# EasyEDA Pro project ProPrj_基于STM32单片机自带校准和温湿度补偿报警的超声波测距仪_2025-01-02.epro, schematic 超声波测距仪
Board Name: 超声波测距仪; Create Date: 2024-11-05; Page Name: 刘嘉俊20223004426; Project Name: 基于STM32单片机自带校准和温湿度补偿报警的超声波测距仪; Schematic Name: 超声波测距仪; Update Date: 2024-12-27; Company: 海南大学-刘嘉俊-电子3班; Drawed: 刘嘉俊; Page Size: A3; Reviewed: 刘嘉俊; Version: Ver1.1
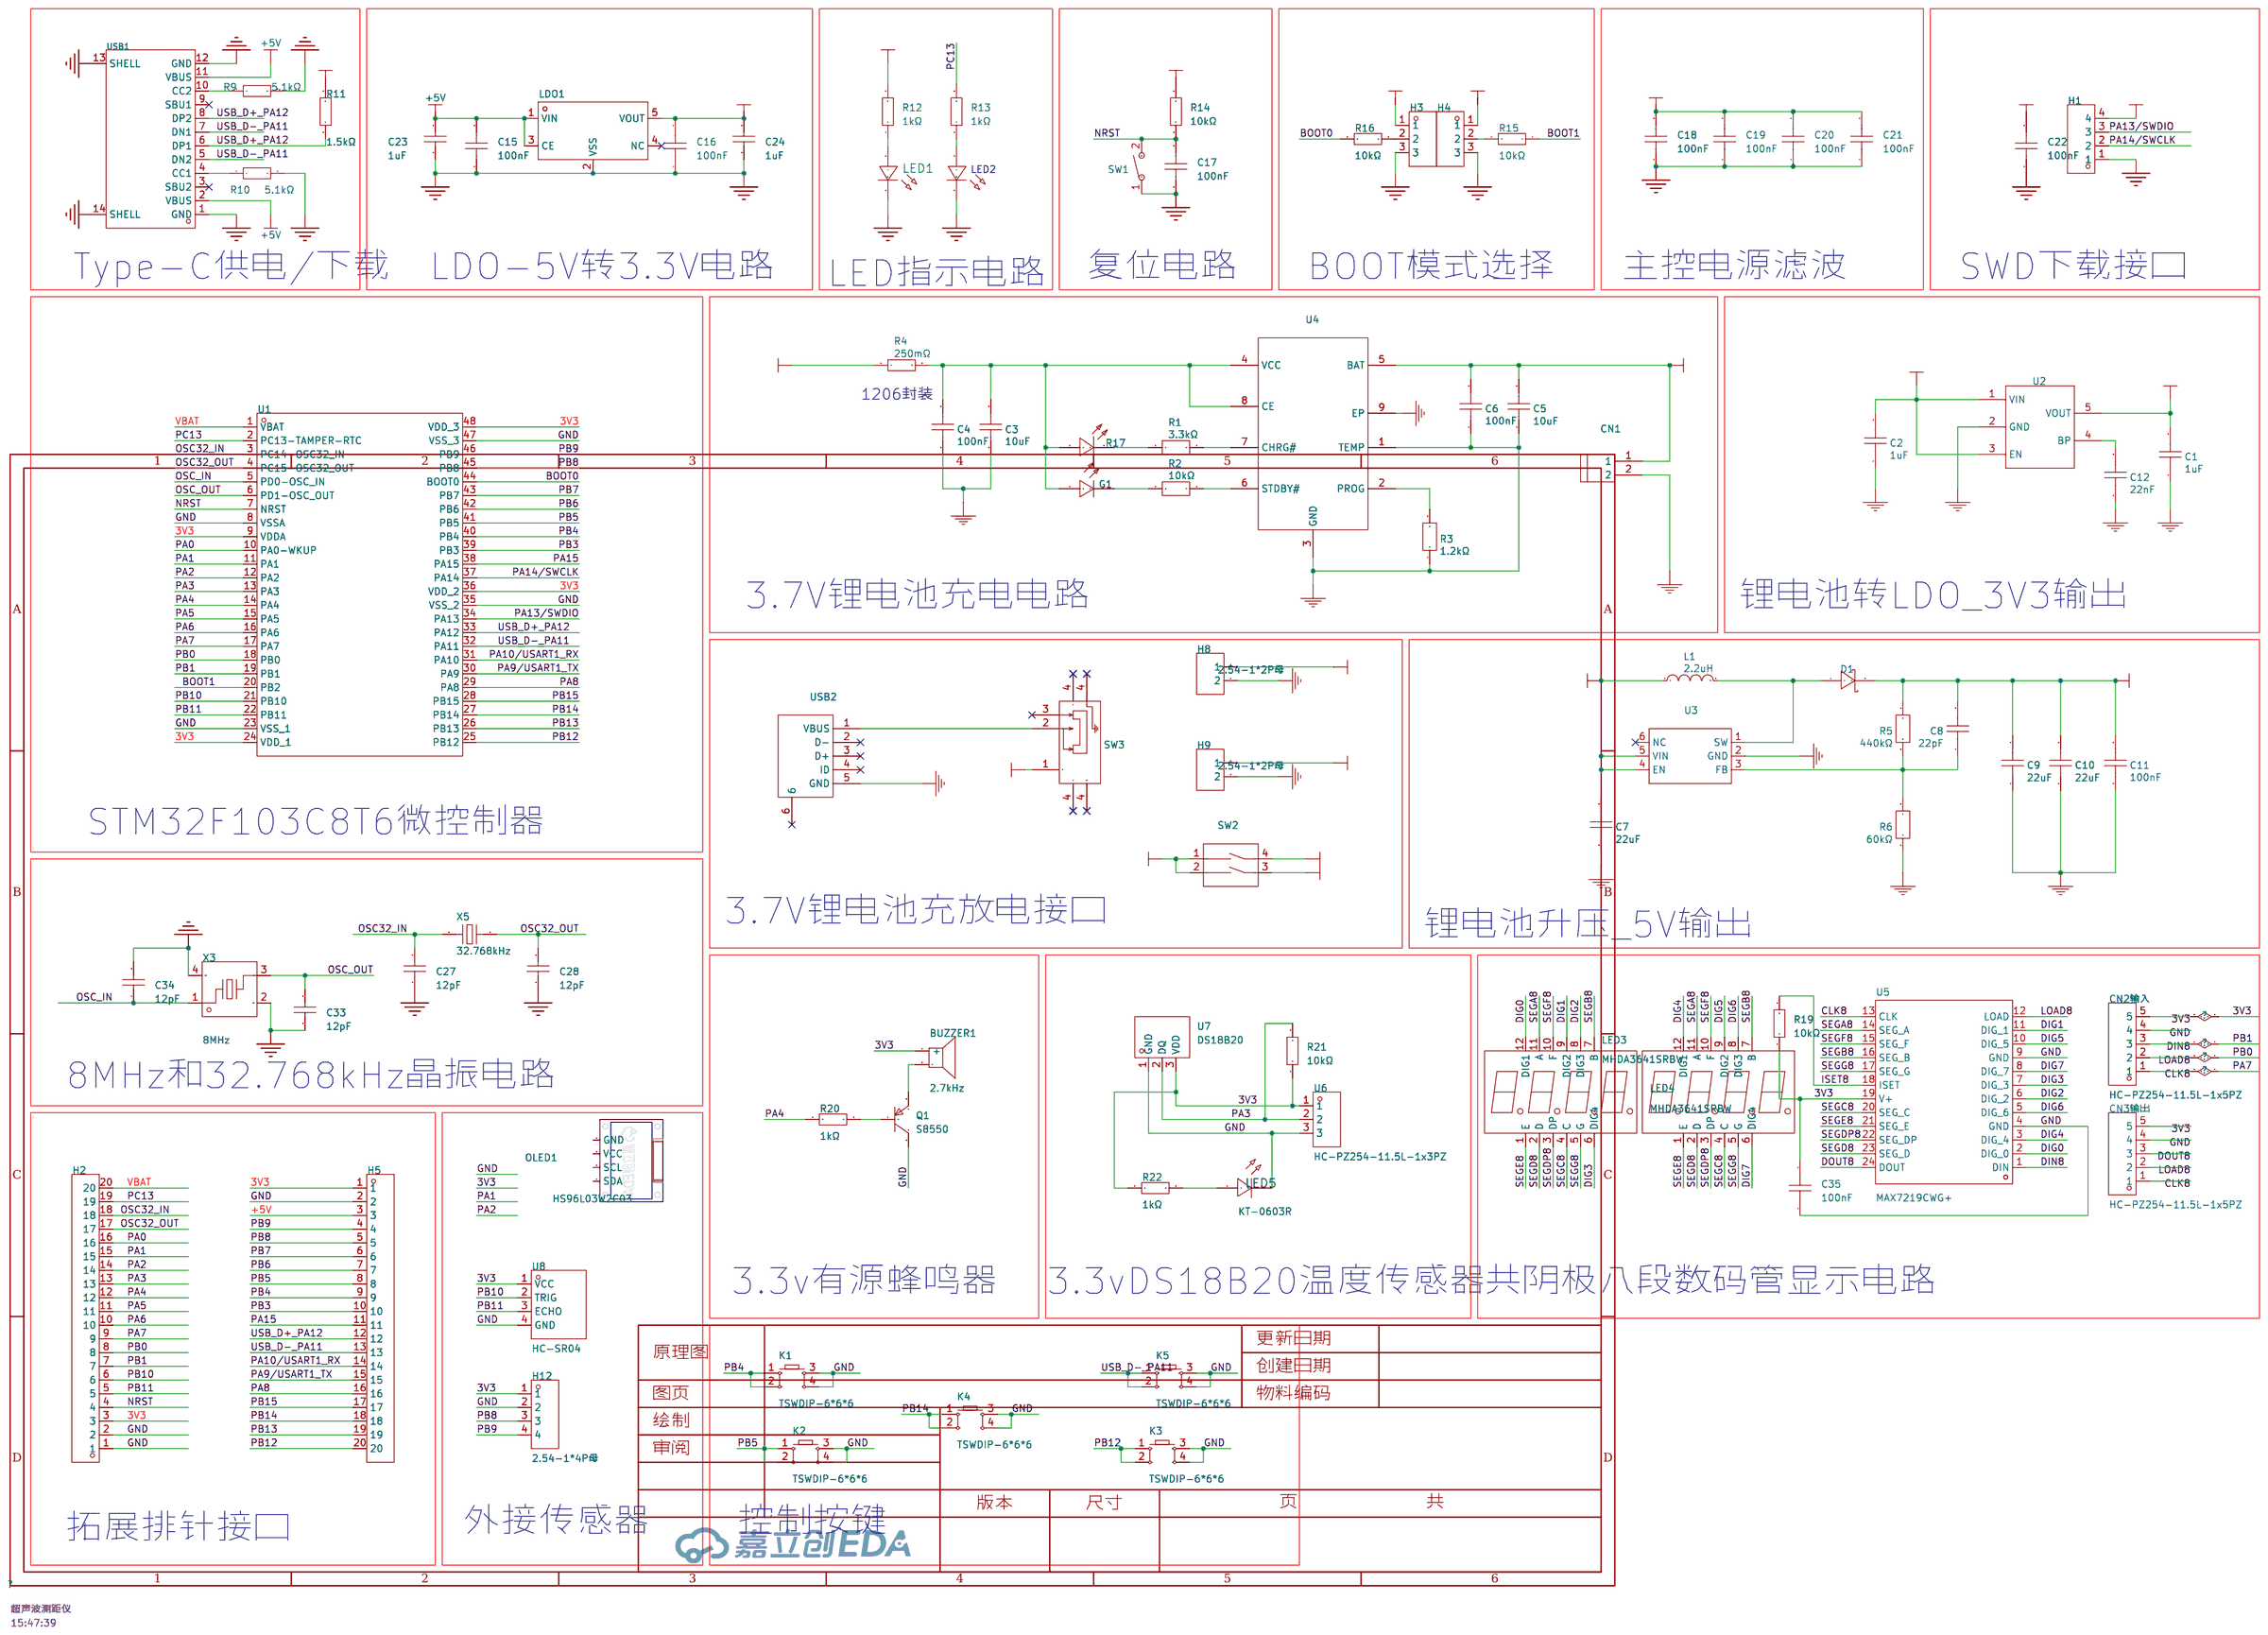
[diagram p0: schematic sheet]

## Parts
BUZZER1  2.7kHz  [BUZ-TH_BD12.0-P7.60-D0.6-FD]
C1  1uF  [C0603]
C2  1uF  [C0603]
C3  10uF  [C0805]
C4  100nF  [C0603]
C5  10uF  [C0805]
C6  100nF  [C0603]
C7  22uF  [C0805]
C8  22pF  [C0603]
C9  22uF  [C0805]
C10  22uF  [C0805]
C11  100nF  [C0603]
C12  22nF  [C0603]
C15  100nF  [C0402]
C16  100nF  [C0402]
C17  100nF  [C0402]
C18  100nF  [C0402]
C19  100nF  [C0402]
C20  100nF  [C0402]
C21  100nF  [C0402]
C22  100nF  [C0402]
C23  1uF  [C0402]
C24  1uF  [C0402]
C27  12pF  [C0402]
C28  12pF  [C0402]
C33  12pF  [C0402]
C34  12pF  [C0402]
C35  100nF  [C0603]
CN1  XH-2AW  [CONN-TH_2P-P2.50_XH-2AW]
CN2输入  HC-PZ254-11.5L-1x5PZ  [HDR-TH_5P-P2.54-V-M]
CN3输出  HC-PZ254-11.5L-1x5PZ  [HDR-TH_5P-P2.54-V-M]
D1  SS34  [SMA_L4.3-W2.6-LS5.2-RD]
G1  NCD0603G1  [LED0603-RD_1]
H1  DZ254W-11-04-65  [HDR-TH_4P-P2.54-H-M-W10.3]
H2  2.54-1*20P直针  [HDR-TH_20P-P2.54-V-M-1]
H3  PZ254V-11-03P  [HDR-TH_3P-P2.54-V-M]
H4  PZ254V-11-03P  [HDR-TH_3P-P2.54-V-M]
H5  2.54-1*20P直针  [HDR-TH_20P-P2.54-V-M-1]
H8  2.54-1*2P母  [HDR-TH_2P-P2.54-V-F]
H9  2.54-1*2P母  [HDR-TH_2P-P2.54-V-F]
H12  2.54-1*4P母  [HDR-TH_4P-P2.54-V-F]
K1  TSWDIP-6*6*6  [KEY-TH_4P-L6.0-W6.0-P4.50-LS6.50]
K2  TSWDIP-6*6*6  [KEY-TH_4P-L6.0-W6.0-P4.50-LS6.50]
K3  TSWDIP-6*6*6  [KEY-TH_4P-L6.0-W6.0-P4.50-LS6.50]
K4  TSWDIP-6*6*6  [KEY-TH_4P-L6.0-W6.0-P4.50-LS6.50]
K5  TSWDIP-6*6*6  [KEY-TH_4P-L6.0-W6.0-P4.50-LS6.50]
L1  2.2uH  [IND-SMD_L5.0-W5.0]
LDO1  ME6211C33M5G-N  [SOT-23-5_L3.0-W1.7-P0.95-LS2.8-BL]
LED1  NCD0603R1  [LED0603-RD_RED]
LED2  NCD0603B1  [LED0603-RD]
LED3  MHDA3641SRBW  [LED-SEG-TH_12P-L30.0-W14.0-P2.54-S10.26-BL]
LED4  MHDA3641SRBW  [LED-SEG-TH_12P-L30.0-W14.0-P2.54-S10.26-BL]
LED5  KT-0603R  [LED0603-RD]
OLED1  HS96L03W2C03  [OLED-TH_L27.8-W27.2-P2.54_C9900033791]
Q1  S8550  [SOT-23-3_L2.9-W1.6-P1.90-LS2.8-BR]
R1  3.3kΩ  [R0603]
R2  10kΩ  [R0603]
R3  1.2kΩ  [R0603]
R4  250mΩ  [R1206]
R5  440kΩ  [R0603]
R6  60kΩ  [R0603]
R9  5.1kΩ  [R0402]
R10  5.1kΩ  [R0402]
R11  1.5kΩ  [R0402]
R12  1kΩ  [R0402]
R13  1kΩ  [R0402]
R14  10kΩ  [R0402]
R15  10kΩ  [R0402]
R16  10kΩ  [R0402]
R17  KT-0603R  [LED0603-RD]
R19  10kΩ  [R0603]
R20  1kΩ  [R0603]
R21  10kΩ  [R0603]
R22  1kΩ  [R0603]
SW1  TS-1101-B-W  [KEY-SMD_2P-L6.0-W3.6-P7.4-LS8.0-L]
SW2  DSDP02LHGET  [SW-TH_DSDP02LHG]
SW3  MSK12C02-HB  [SW-TH_MSK12C02-HB-1]
U1  STM32F103C8T6  [LQFP-48_L7.0-W7.0-P0.50-LS9.0-BL]
U2  RT9193-33GB  [SOT-23-5_L3.0-W1.7-P0.95-LS2.8-BL]
U3  MST9220BSF  [SOT-23-6_L2.9-W1.6-P0.95-LS2.8-BR]
U4  TP4056-42-ESOP8  [ESOP-8_L4.9-W3.9-P1.27-LS6.0-BL-EP]
U5  MAX7219CWG+  [SOIC-24_L15.4-W7.5-P1.27-LS10.3-BL]
U6  HC-PZ254-11.5L-1x3PZ  [HDR-TH_3P-P2.54-V-M]
U7  DS18B20  [TO-92-3_L4.9-W3.7-P1.27-L]
U8  HC-SR04  [TH_HC-SR04V]
USB1  TYPE-C 16PIN 2MD(073)  [USB-C-SMD_TYPE-C-6PIN-2MD-073]
USB2  MICRO5.9mmusb  [MICRO-USB-SMD_5P-P0.65-H-F_MICRO5.9MMUSB]
X3  8MHz  [CRYSTAL-SMD_4P-L3.2-W2.5-BL-1]
X5  32.768kHz  [OSC-SMD_L3.2-W1.5]

## Library data of the parts
BUZZER1 = TMB12A05_C96093: 驱动方式:有源(内含驱动线路);构造类型:电磁式;频率:2.7kHz;声压(SPL):85dB;; LCSC Part Name: TMB12A05; Supplier Part: C96093; Manufacturer: 华能; Manufacturer Part: TMB12A05; Supplier Footprint: 插件,D=12mm; JLCPCB Part Class: 扩展库; Datasheet: https://atta.szlcsc.com/upload/public/pdf/source/20230426/A4FC10532558AA232D532AB83455FBA4.pdf; Supplier: LCSC; Oscillator Circuit: 有源(内含驱动线路); Technology Type: 电磁式; Operating Voltage: 4V~8V; Sound Pressure Level (SPL): 85dB; Diameter (φD): 12mm; Height: 9.8mm
C1 C2 = CL10A105KB8NNNC: 容值:1uF;精度:±10%;额定电压:50V;材质(温度系数):X5R;; LCSC Part Name: 1uF ±10% 50V; Supplier Part: C15849; Manufacturer: SAMSUNG(三星); Supplier Footprint: 0603; JLCPCB Part Class: Basic Part; Datasheet: https://atta.szlcsc.com/upload/public/pdf/source/20160218/1457707763339.pdf; Supplier: LCSC; Tolerance: ±10%; Voltage Rated: 50V; Temperature Coefficient: X5R
C3 C5 = CL21A106KAYNNNE_C15850: 容值:10uF;精度:±10%;额定电压:25V;材质(温度系数):X5R;; LCSC Part Name: 10uF ±10% 25V; Supplier Part: C15850; Manufacturer: SAMSUNG(三星); Manufacturer Part: CL21A106KAYNNNE; Supplier Footprint: 0805; JLCPCB Part Class: Basic Part; Datasheet: https://atta.szlcsc.com/upload/public/pdf/source/20160218/1457707763339.pdf; Supplier: LCSC; Tolerance: ±10%; Voltage Rated: 25V; Temperature Coefficient: X5R
C4 C6 C11 C35 = CC0603KRX7R9BB104: 容值:100nF;精度:±10%;额定电压:50V;材质(温度系数):X7R;; LCSC Part Name: 100nF ±10% 50V; Supplier Part: C14663; Manufacturer: YAGEO(国巨); Supplier Footprint: 0603; JLCPCB Part Class: Basic Part; Datasheet: https://atta.szlcsc.com/upload/public/pdf/source/20180910/C282072_33301C7F631E79921B82A8DAC6BCC5B3.pdf; Supplier: LCSC; Tolerance: ±10%; Voltage Rated: 50V; Temperature Coefficient: X7R
C7 C9 C10 = CL21A226MAQNNNE: 容值:22uF;精度:±20%;额定电压:25V;材质(温度系数):X5R;; LCSC Part Name: 22uF ±20% 25V; Supplier Part: C45783; Manufacturer: SAMSUNG(三星); Supplier Footprint: 0805; JLCPCB Part Class: Basic Part; Datasheet: https://atta.szlcsc.com/upload/public/pdf/source/20160218/1457707763339.pdf; Supplier: LCSC; Tolerance: ±20%; Voltage Rated: 25V; Temperature Coefficient: X5R
C8 = CL10C220JB8NNNC: 容值:22pF;精度:±5%;额定电压:50V;材质(温度系数):C0G;; LCSC Part Name: 22pF ±5% 50V; Supplier Part: C1653; Manufacturer: SAMSUNG(三星); Supplier Footprint: 0603; JLCPCB Part Class: Basic Part; Datasheet: https://atta.szlcsc.com/upload/public/pdf/source/20160218/1457707763339.pdf; Supplier: LCSC; Tolerance: ±5%; Voltage Rated: 50V; Temperature Coefficient: C0G
C12 = CL10B223KB8NNNC: 容值:22nF;精度:±10%;额定电压:50V;材质(温度系数):X7R;; LCSC Part Name: 22nF ±10% 50V; Supplier Part: C21122; Manufacturer: SAMSUNG(三星); Supplier Footprint: 0603; JLCPCB Part Class: Basic Part; Datasheet: https://atta.szlcsc.com/upload/public/pdf/source/20160218/1457707763339.pdf; Supplier: LCSC; Tolerance: ±10%; Voltage Rated: 50V; Temperature Coefficient: X7R
C15-C22 = GRM155R71H104KE14D: 容值:100nF;精度:±10%;额定电压:50V;材质(温度系数):X7R;; LCSC Part Name: 100nF ±10% 50V; Supplier Part: C77020; Manufacturer: muRata(村田); Supplier Footprint: 0402; JLCPCB Part Class: Extended Part; Datasheet: https://atta.szlcsc.com/upload/public/pdf/source/20180326/C77020_39BD49C951FF1AF0DB1F1FAC5AC1E401.pdf; Supplier: LCSC; Tolerance: ±10%; Voltage Rated: 50V; Temperature Coefficient: X7R
C23 C24 = CL05A105KP5NNNC: 容值:1uF;精度:±10%;额定电压:10V;材质(温度系数):X5R;; LCSC Part Name: 1uF ±10% 10V; Supplier Part: C14445; Manufacturer: SAMSUNG(三星); Supplier Footprint: 0402; JLCPCB Part Class: Extended Part; Datasheet: https://atta.szlcsc.com/upload/public/pdf/source/20160218/1457707763339.pdf; Supplier: LCSC; Tolerance: ±10%; Voltage Rated: 10V; Temperature Coefficient: X5R
C27 C28 C33 C34 = 0402CG120J500NT: 容值:12pF;精度:±5%;额定电压:50V;材质(温度系数):C0G;; LCSC Part Name: 12pF ±5% 50V; Supplier Part: C1547; Manufacturer: FH(风华); Supplier Footprint: 0402; JLCPCB Part Class: Basic Part; Datasheet: https://atta.szlcsc.com/upload/public/pdf/source/20200305/C486355_26A10D38EF8C2A5C37091D0039909270.pdf; Supplier: LCSC; Tolerance: ±5%; Voltage Rated: 50V; Temperature Coefficient: C0G
CN1 = XH-2AW_C33132: 插针结构:1x2P;间距:2.5mm;安装方式:弯插;参考系列:XH;总PIN数:2P;排数:1;每排PIN数:2;行距:-;触头材质:磷青铜;; LCSC Part Name: 系列:XH 间距:2.5mm 1x2P; Supplier Part: C33132; Manufacturer: BOOMELE(博穆精密); Supplier Footprint: 弯插,P=2.5mm; JLCPCB Part Class: Extended Part; Datasheet: https://atta.szlcsc.com/upload/public/pdf/source/20151222/1457707654251.pdf; Supplier: LCSC; Pins Structure: 1x2P; Pitch: 2.5mm; Mounting Style: 弯插; Reference Series: XH; Number of Pins: 2P; Number of Rows: 1; Number of PINs Per Row: 2; Contact Material: 磷青铜
CN2输入 CN3输出 = HC-PZ254-11.5L-1x5PZ: 插针结构:1x5P;间距:2.54mm;行距:-;圆针/方针:方针;安装类型:直插;排数:单排;总PIN位数:5P;额定电流:3A;配合针长度:6mm;塑高:2.5mm;端接针长度:3mm;触头材质:黄铜;触头镀层:金;工作温度范围:-40℃~+105℃;焊接温度(最大值):260℃;颜色:黑色;; LCSC Part Name: 间距2.54mm 1x5Pin 直插 H2.5 L11.5; Supplier Part: C27985190; Manufacturer: HC(虹成电子); Supplier Footprint: 插件,P=2.54mm; JLCPCB Part Class: 扩展库; Datasheet: https://atta.szlcsc.com/upload/public/pdf/source/20240710/9646E7AD10E42E713FE23605CE048B80.pdf; Supplier: LCSC; Pin Structure: 1x5P; Pitch: 2.54mm; Circluar Pins/Square Pins: 方针; Mounting Type: 直插; Number of Rows: 单排; Number of Pins: 5P; Current Rating (Max): 3A; Length of Mating Pin: 6mm; Insulation Height: 2.5mm; Length of End Connection Pin: 3mm; Contact Material: 黄铜; Contact Plating: 金; Operating Temperature Range: -40℃~+105℃; Soldering Temperature(Max): 260℃; Color: 黑色
D1 = SS34_C8678: 二极管配置:独立式;正向压降(Vf):550mV@3A;直流反向耐压(Vr):40V;整流电流:3A;; LCSC Part Name: 电压:40V 电流:3A; Supplier Part: C8678; Manufacturer: MDD(辰达半导体); Supplier Footprint: SMA(DO-214AC); JLCPCB Part Class: Basic Part; Datasheet: https://atta.szlcsc.com/upload/public/pdf/source/20240710/2118BB86FDDB2E0B294389AC1F3F65C8.pdf; Supplier: LCSC; Diode Configuration: 独立式; Forward Voltage (Vf@If): 550mV@3A; Reverse Voltage (Vr): 40V; Rectified Current: 3A; Reverse Leakage Current (Ir): 500uA@40V
G1 = NCD0603G1: 发光颜色:翠绿色;正向电压(VF):2.6V~3.6V;功率:72mW;正向电流:10mA;主波长:515nm~530nm;透镜颜色:无色透明透镜;发光强度:330mcd~900mcd;发光角度:130°;工作温度:-30℃~+85℃;; Supplier Part: C84267; Manufacturer: 国星光电; Supplier Footprint: 0603; JLCPCB Part Class: Extended Part; Datasheet: https://atta.szlcsc.com/upload/public/pdf/source/20200820/C84267_04BA7703640BAC111D09F5EFB971FBF3.pdf; Supplier: LCSC; Emitted Color: 翠绿色; Forward Voltage (VF): 2.6V~3.6V; Power Dissipation: 72mW; Forward Current: 10mA; Dominant Wavelength: 515nm~530nm; Lens Color: 无色透明透镜; Luminous Intensity: 330mcd~900mcd; Viewing Angle: 130°; Operating Temperature: -30℃~+85℃
H1 = DZ254W-11-04-65: 插针结构:1x4P;间距:2.54mm;行距:-;圆针/方针:方针;安装类型:弯插;排数:单排;总PIN位数:4P;额定电流:3A;额定电压:-;配合针长度:6mm;塑高:2.54mm;端接针长度:-;工作温度范围:-;颜色:-;; LCSC Part Name: 间距:2.54mm 1x4P 弯插 方针; Supplier Part: C2935929; Manufacturer: DEALON(德艺隆); Supplier Footprint: 弯插,P=2.54mm; JLCPCB Part Class: Extended Part; Datasheet: https://atta.szlcsc.com/upload/public/pdf/source/20211231/CEC96EEC99F3217E207F74B399519373.pdf; Supplier: LCSC; Pin Structure: 1x4P; Pitch: 2.54mm; Circluar Pins/Square Pins: 方针; Mounting Type: 弯插; Number of Rows: 单排; Number of Pins: 4P; Current Rating (Max): 3A; Length of Mating Pin: 6mm; Insulation Height: 2.54mm
H2 H5 = 2.54-1*20P直针: 插针结构:1x20P;间距:2.54mm;行距:-;圆针/方针:方针;安装类型:直插;排数:单排;总PIN位数:20P;额定电流:3A;额定电压:-;配合针长度:-;塑高:-;端接针长度:-;触头材质:黄铜;触头镀层:-;工作温度范围:-40℃~+105℃;颜色:黑色;; LCSC Part Name: 间距:2.54mm 1x20P 直插 方针; Supplier Part: C50981; Manufacturer: BOOMELE(博穆精密); Supplier Footprint: 插件,P=2.54mm; JLCPCB Part Class: Extended Part; Datasheet: https://atta.szlcsc.com/upload/public/pdf/source/20151109/1457707572883.pdf; Supplier: LCSC; Pin Structure: 1x20P; Pitch: 2.54mm; Circluar Pins/Square Pins: 方针; Mounting Type: 直插; Number of Rows: 单排; Number of Pins: 20P; Current Rating (Max): 3A; Contact Material: 黄铜; Operating Temperature Range: -40℃~+105℃; Color: 黑色
H3 H4 = PZ254V-11-03P: 插针结构:1x3P;间距:2.54mm;行距:-;圆针/方针:方针;安装类型:直插;排数:单排;总PIN位数:3P;额定电流:3A;额定电压:250V;配合针长度:6mm;塑高:2.5mm;端接针长度:3mm;工作温度范围:-40℃~+105℃;颜色:黑色;; LCSC Part Name: 间距:2.54mm 1x3P 直插 方针; Supplier Part: C2937625; Manufacturer: XFCN(兴飞); Supplier Footprint: 插件,P=2.54mm; JLCPCB Part Class: Extended Part; Datasheet: https://atta.szlcsc.com/upload/public/pdf/source/20200309/C492402_8335C3D49C4E4C618838D59BB1D024C1.pdf; Supplier: LCSC; Pin Structure: 1x3P; Pitch: 2.54mm; Circluar Pins/Square Pins: 方针; Mounting Type: 直插; Number of Rows: 单排; Number of Pins: 3P; Current Rating (Max): 3A; Voltage Rating (Max): 250V; Length of Mating Pin: 6mm; Insulation Height: 2.5mm; Length of End Connection Pin: 3mm; Operating Temperature Range: -40℃~+105℃; Color: 黑色
H8 H9 = 2.54-1*2P母: 插孔结构:1x2P;间距:2.54mm;行距:-;安装类型:直插;排数:单排;总孔位数:2P;塑高:-;触头材质:-;触头镀层:-;; LCSC Part Name: 间距:2.54mm 1x2P 直插; Supplier Part: C49661; Manufacturer: BOOMELE(博穆精密); Supplier Footprint: 插件,P=2.54mm; JLCPCB Part Class: Extended Part; Datasheet: https://atta.szlcsc.com/upload/public/pdf/source/20210301/C2718488_F4427B881E42CAA8DDB0B1C12B3A522C.pdf; Supplier: LCSC; Holes Structure: 1x2P; Pitch: 2.54mm; Mounting Type: 直插; Number of Rows: 单排; Number of Holes: 2P
H12 = 2.54-1*4P母: 插孔结构:1x4P;间距:2.54mm;行距:-;圆孔/方孔:方孔;安装类型:直插;排数:单排;总孔位数:4P;额定电流:3A;额定电压:-;插孔方向:顶部;塑高:-;触头材质:青铜;触头镀层:-;工作温度范围:-40℃~+105℃;焊接温度(最大值):-;; LCSC Part Name: 间距:2.54mm 1x4P 直插; Supplier Part: C2718488; Manufacturer: BOOMELE(博穆精密); Supplier Footprint: 插件,P=2.54mm; JLCPCB Part Class: Extended Part; Datasheet: https://atta.szlcsc.com/upload/public/pdf/source/20210301/C2718488_F4427B881E42CAA8DDB0B1C12B3A522C.pdf; Supplier: LCSC; Holes Structure: 1x4P; Pitch: 2.54mm; Circular Hole / Square Hole: 方孔; Mounting Type: 直插; Number of Rows: 单排; Number of Holes: 4P; Current Rating (Max): 3A; Holes Direction: 顶部; Contact Material: 青铜; Operating Temperature Range: -40℃~+105℃
K1-K5 = TSWDIP-6*6*6: Supplier Part: C9900020134; JLCPCB Part Class: Extended Part; Supplier: LCSC
L1 = CKCS5020-2.2uH/M: 电感值:2.2uH;精度:±20%;额定电流:2.7A;饱和电流(Isat):3.2A;类型:磁胶电感;; LCSC Part Name: 2.2uH ±20%; Supplier Part: C354595; Manufacturer: CENKER(岑科); Supplier Footprint: SMD,5x5mm; JLCPCB Part Class: Extended Part; Datasheet: https://atta.szlcsc.com/upload/public/pdf/source/20190315/C354623_FFFAD03D5912F156EAD6541D59E4BFA6.pdf; Supplier: LCSC; Tolerance: ±20%; Rated Current: 2.7A; Saturation Current (Isat): 3.2A; DC Resistance (DCR): 40mΩ; Type: 磁胶电感
LDO1 = ME6211C33M5G-N: 输出类型:固定;输出极性:正;最大输入电压:6V;输出电压:3.3V;输出电流:500mA;电源纹波抑制比(PSRR):70dB;; Supplier Part: C82942; Manufacturer: MICRONE(南京微盟); Supplier Footprint: SOT-23-5; JLCPCB Part Class: 扩展库; Datasheet: https://atta.szlcsc.com/upload/public/pdf/source/20170918/C82942_1505727073070976520.pdf; Supplier: LCSC; Output Type: 固定; Output Polarity: 正; Number of Outputs: 1; Maximum Input Voltage: 6V; Output Voltage: 3.3V; Dropout Voltage: 260mV@(200mA); Output Current: 500mA; Power Supply Rejection Ratio (PSRR): 70dB
LED1 = NCD0603R1_C84263: 灯头类型:-;发光颜色:红色;正向电压(VF):1.6V~2.6V;功率:65mW;正向电流:20mA;主波长:615nm~630nm;二极管配置:独立二极管;透镜颜色:无色透明透镜;色温:-;发光强度:80mcd~220mcd;发光角度:130°;载带方式:-;工作温度:-30℃~+85℃;; Supplier Part: C84263; Manufacturer: 国星光电; Supplier Footprint: 0603; JLCPCB Part Class: Extended Part; Datasheet: https://atta.szlcsc.com/upload/public/pdf/source/20200820/C84263_DABC6A75E58F576973B407FDBA283D60.pdf; Supplier: LCSC; Emitted Color: 红色; Forward Voltage (VF): 1.6V~2.6V; Power Dissipation: 65mW; Forward Current: 20mA; Dominant Wavelength: 615nm~630nm; Diode Configuration: 独立二极管; Lens Color: 无色透明透镜; Luminous Intensity: 80mcd~220mcd; Viewing Angle: 130°; Operating Temperature: -30℃~+85℃
LED2 = NCD0603B1: 发光颜色:蓝色;正向电压(VF):2.6V~3.6V;功率:72mW;正向电流:10mA;主波长:463nm~475nm;透镜颜色:无色透明透镜;发光强度:80mcd~220mcd;发光角度:130°;工作温度:-30℃~+85℃;; Supplier Part: C84266; Manufacturer: 国星光电; Supplier Footprint: 0603; JLCPCB Part Class: Extended Part; Datasheet: https://atta.szlcsc.com/upload/public/pdf/source/20200820/C84266_6A3CDBEFA72C6CAD68EDA53474ADAE6C.pdf; Supplier: LCSC; Emitted Color: 蓝色; Forward Voltage (VF): 2.6V~3.6V; Power Dissipation: 72mW; Forward Current: 10mA; Dominant Wavelength: 463nm~475nm; Lens Color: 无色透明透镜; Luminous Intensity: 80mcd~220mcd; Viewing Angle: 130°; Operating Temperature: -30℃~+85℃
LED3 LED4 = MHDA3641SRBW: 数码管位数:4位;功耗:50mW;发光颜色:红色;LED极性:共阳极;数字/字母大小(英寸):0.362;; LCSC Part Name: 0.36直插数码管共阳四八红色光; Supplier Part: C401125; Manufacturer: MEIHUA(美华); Supplier Footprint: 插件; JLCPCB Part Class: 扩展库; Datasheet: https://atta.szlcsc.com/upload/public/pdf/source/20190702/C401125_F14C17DD30B802E2CDFB70771ABE2107.pdf; Supplier: LCSC; Number of Characters: 4位; Module Size: 30mmx14mmx7.2mm; Power Dissipation: 50mW; Luminous Color: 红色; LED Polarity: 共阳极; Digit/Alpha Size(inch): 0.362
LED5 R17 = KT-0603R: 发光颜色:红色;功率:-;正向电流:-;主波长:-;二极管配置:-;透镜颜色:-;色温:-;发光角度:-;载带方式:-;工作温度:-40℃~+85℃;; LCSC Part Name: 0603 红灯 高亮; Supplier Part: C2286; Manufacturer: KENTO; Supplier Footprint: 0603; JLCPCB Part Class: Basic Part; Datasheet: https://atta.szlcsc.com/upload/public/pdf/source/20160616/1466072038404.pdf; Supplier: LCSC; Emitted Color: 红色; Operating Temperature: -40℃~+85℃
OLED1 = HS96L03W2C03: 主控芯片:SSD1315;接口类型:I2C;尺寸(inch):0.96;像素分辨率:128x64;; LCSC Part Name: 0.96寸OLED显示屏窄白光IIC; Supplier Part: C5248080; Manufacturer: HS(汉昇); JLCPCB Part Class: Extended Part; Datasheet: https://atta.szlcsc.com/upload/public/pdf/source/20230627/763D01F79A90007632F098068C7C8AD9.pdf; Supplier: LCSC; Main Control Chip: SSD1315; Interface Type: I2C; Size: 0.96; Pixel Resolution: 128x64; Operating Temperature: -40℃~+70℃
Q1 = S8550_C181159: 晶体管类型:PNP;集电极电流(Ic):500mA;集射极击穿电压(Vceo):25V;功率(Pd):300mW;; LCSC Part Name: PNP 电流:500mA 耐压:25V; Supplier Part: C181159; Manufacturer: Hottech(合科泰); Supplier Footprint: SOT-23; JLCPCB Part Class: 扩展库; Datasheet: https://atta.szlcsc.com/upload/public/pdf/source/20220506/DB226E6DCB1B20BD416878FDC9C7258D.pdf; Supplier: LCSC; Transistor Type: PNP; Collector Current (Ic): 500mA; Collector-Emitter Breakdown Voltage (Vceo): 25V; Power Dissipation (Pd): 300mW; Transition Frequency (fT): 150MHz; Collector Cut-Off Current (Icbo): 100nA; Collector-Emitter Saturation Voltage (VCE(sat)@Ic,Ib): 600mV@500mA,50mA
R1 = 0603WAF3301T5E: 电阻类型:厚膜电阻;阻值:3.3kΩ;精度:±1%;功率:100mW;最大工作电压:75V;温度系数:±100ppm/℃;; LCSC Part Name: 3.3kΩ ±1% 100mW 厚膜电阻; Supplier Part: C22978; Manufacturer: UNI-ROYAL(厚声); Supplier Footprint: 0603; JLCPCB Part Class: Basic Part; Datasheet: https://atta.szlcsc.com/upload/public/pdf/source/20200306/C422600_1E6D84923E4A46A82E41ADD87F860B5C.pdf; Supplier: LCSC; Type: 厚膜电阻; Tolerance: ±1%; Power(Watts): 100mW; Overload Voltage (Max): 75V; Temperature Coefficient: ±100ppm/℃; Operating Temperature Range: -55℃~+155℃
R2 R19 R21 = 0603WAF1002T5E: 电阻类型:厚膜电阻;阻值:10kΩ;精度:±1%;功率:100mW;最大工作电压:75V;温度系数:±100ppm/℃;; LCSC Part Name: 厚膜电阻 10kΩ ±1% 100mW; Supplier Part: C25804; Manufacturer: UNI-ROYAL(厚声); Supplier Footprint: 0603; JLCPCB Part Class: Basic Part; Datasheet: https://atta.szlcsc.com/upload/public/pdf/source/20200306/C422600_1E6D84923E4A46A82E41ADD87F860B5C.pdf; Supplier: LCSC; Type: 厚膜电阻; Tolerance: ±1%; Power(Watts): 100mW; Overload Voltage (Max): 75V; Temperature Coefficient: ±100ppm/℃; Operating Temperature Range: -55℃~+155℃
R3 = 0603WAF1201T5E: 电阻类型:厚膜电阻;阻值:1.2kΩ;精度:±1%;功率:100mW;最大工作电压:75V;温度系数:±100ppm/℃;; LCSC Part Name: 1.2kΩ ±1% 100mW 厚膜电阻; Supplier Part: C22765; Manufacturer: UNI-ROYAL(厚声); Supplier Footprint: 0603; JLCPCB Part Class: Basic Part; Datasheet: https://atta.szlcsc.com/upload/public/pdf/source/20200306/C422600_1E6D84923E4A46A82E41ADD87F860B5C.pdf; Supplier: LCSC; Type: 厚膜电阻; Tolerance: ±1%; Power(Watts): 100mW; Overload Voltage (Max): 75V; Temperature Coefficient: ±100ppm/℃; Operating Temperature Range: -55℃~+155℃
R4 = RL12FTNR250: 阻值:250mΩ;精度:±1%;功率:500mW;温度系数:±200ppm/℃;; LCSC Part Name: 250mΩ ±1% 500mW; Supplier Part: C160921; Manufacturer: 大毅科技; Supplier Footprint: 1206; JLCPCB Part Class: Extended Part; Datasheet: https://atta.szlcsc.com/upload/public/pdf/source/20180614/C188071_126E822E8169D657E3D39CA4797EDEB1.pdf; Supplier: LCSC; Tolerance: ±1%; Power(Watts): 500mW; Temperature Coefficient: ±200ppm/℃
R5 = CR0603F440KP05: 电阻类型:厚膜电阻;阻值:440kΩ;精度:±1%;; LCSC Part Name: 厚膜电阻 440kΩ ±1%; Supplier Part: C5309886; Manufacturer: EVER OHMS(天二科技); Supplier Footprint: 0603; JLCPCB Part Class: Extended Part; Supplier: LCSC; Type: 厚膜电阻; Tolerance: ±1%; Operating Temperature Range: -55℃~+155℃
R6 = 0603WAF6002T5E: 电阻类型:厚膜电阻;阻值:60kΩ;精度:±1%;功率:100mW;最大工作电压:75V;温度系数:±100ppm/℃;; LCSC Part Name: 60kΩ ±1% 100mW 厚膜电阻; Supplier Part: C2767205; Manufacturer: UNI-ROYAL(厚声); Supplier Footprint: 0603; JLCPCB Part Class: Extended Part; Datasheet: https://atta.szlcsc.com/upload/public/pdf/source/20200306/C422600_1E6D84923E4A46A82E41ADD87F860B5C.pdf; Supplier: LCSC; Type: 厚膜电阻; Tolerance: ±1%; Power(Watts): 100mW; Overload Voltage (Max): 75V; Temperature Coefficient: ±100ppm/℃; Operating Temperature Range: -55℃~+155℃
R9 R10 = 0402WGF5101TCE: 电阻类型:厚膜电阻;阻值:5.1kΩ;精度:±1%;功率:62.5mW;最大工作电压:50V;温度系数:±100ppm/℃;; LCSC Part Name: 5.1kΩ ±1% 62.5mW 厚膜电阻; Supplier Part: C25905; Manufacturer: UNI-ROYAL(厚声); Supplier Footprint: 0402; JLCPCB Part Class: 基础库; Datasheet: https://atta.szlcsc.com/upload/public/pdf/source/20200306/C422600_1E6D84923E4A46A82E41ADD87F860B5C.pdf; Supplier: LCSC; Type: 厚膜电阻; Tolerance: ±1%; Power(Watts): 62.5mW; Overload Voltage (Max): 50V; Temperature Coefficient: ±100ppm/℃; Operating Temperature Range: -55℃~+155℃
R11 = 0402WGF1501TCE: 电阻类型:厚膜电阻;阻值:1.5kΩ;精度:±1%;功率:62.5mW;最大工作电压:50V;温度系数:±100ppm/℃;; LCSC Part Name: 1.5kΩ ±1% 62.5mW 厚膜电阻; Supplier Part: C25867; Manufacturer: UNI-ROYAL(厚声); Supplier Footprint: 0402; JLCPCB Part Class: 基础库; Datasheet: https://atta.szlcsc.com/upload/public/pdf/source/20200306/C422600_1E6D84923E4A46A82E41ADD87F860B5C.pdf; Supplier: LCSC; Type: 厚膜电阻; Tolerance: ±1%; Power(Watts): 62.5mW; Overload Voltage (Max): 50V; Temperature Coefficient: ±100ppm/℃; Operating Temperature Range: -55℃~+155℃
R12 R13 = 0402WGF1001TCE: 电阻类型:厚膜电阻;阻值:1kΩ;精度:±1%;功率:62.5mW;最大工作电压:50V;温度系数:±100ppm/℃;; LCSC Part Name: 1kΩ ±1% 62.5mW 厚膜电阻; Supplier Part: C11702; Manufacturer: UNI-ROYAL(厚声); Supplier Footprint: 0402; JLCPCB Part Class: 基础库; Datasheet: https://atta.szlcsc.com/upload/public/pdf/source/20200306/C422600_1E6D84923E4A46A82E41ADD87F860B5C.pdf; Supplier: LCSC; Type: 厚膜电阻; Tolerance: ±1%; Power(Watts): 62.5mW; Overload Voltage (Max): 50V; Temperature Coefficient: ±100ppm/℃; Operating Temperature Range: -55℃~+155℃
R14-R16 = RC0402FR-0710KL: 电阻类型:厚膜电阻;阻值:10kΩ;精度:±1%;功率:62.5mW;最大工作电压:50V;温度系数:±100ppm/℃;; LCSC Part Name: 厚膜电阻 10kΩ ±1% 62.5mW; Supplier Part: C60490; Manufacturer: YAGEO(国巨); Supplier Footprint: 0402; JLCPCB Part Class: 扩展库; Datasheet: https://atta.szlcsc.com/upload/public/pdf/source/20170925/C131467_1506321478108990263.pdf; Supplier: LCSC; Type: 厚膜电阻; Tolerance: ±1%; Power(Watts): 62.5mW; Overload Voltage (Max): 50V; Temperature Coefficient: ±100ppm/℃; Operating Temperature Range: -55℃~+155℃
R20 R22 = 0603WAF1001T5E: 电阻类型:厚膜电阻;阻值:1kΩ;精度:±1%;功率:100mW;最大工作电压:75V;温度系数:±100ppm/℃;; LCSC Part Name: 1kΩ ±1% 100mW 厚膜电阻; Supplier Part: C21190; Manufacturer: UNI-ROYAL(厚声); Supplier Footprint: 0603; JLCPCB Part Class: Basic Part; Datasheet: https://atta.szlcsc.com/upload/public/pdf/source/20200306/C422600_1E6D84923E4A46A82E41ADD87F860B5C.pdf; Supplier: LCSC; Type: 厚膜电阻; Tolerance: ±1%; Power(Watts): 100mW; Overload Voltage (Max): 75V; Temperature Coefficient: ±100ppm/℃; Operating Temperature Range: -55℃~+155℃
SW1 = TS-1101-B-W_C500065: 触点电流:50mA;额定电压(DC):12V;绝缘电阻:-;电路结构:单刀单掷;安装方式:立贴;带灯:无;作用力:160gf;机械寿命:5万次;带支架:否;; LCSC Part Name: 6*3.6*2.5mm 立贴 轻触开关; Supplier Part: C500065; Manufacturer: XKB Connectivity(中国星坤); Supplier Footprint: SMD; JLCPCB Part Class: 扩展库; Datasheet: https://atta.szlcsc.com/upload/public/pdf/source/20211011/D0E0CAF534F7B19DDE4CE68748A25BD3.pdf; Supplier: LCSC; Contact Current: 50mA; Voltage Rating (DC): 12V; Circuit: 单刀单掷; Mounting Style: 立贴; Actuator Style: 矩形按钮; Actuator/Cap Color: 白色; With Lamp: 无; Operating Force: 160gf; Mechanical Life: 5万次; Operating Temperature: -30℃~+85℃; Switch Length: 6mm; Switch Width: 3.6mm; Switch Height: 2.5mm; Strike Gundam: 否
SW2 = DSDP02LHGET: 类型:琴键;电路结构:单刀单掷;开关位数:2位;使用寿命:-;颜色:红色;; Supplier Part: C105539; Manufacturer: YE; Supplier Footprint: 插件; JLCPCB Part Class: Extended Part; Datasheet: https://atta.szlcsc.com/upload/public/pdf/source/20170413/1492054903389.pdf; Supplier: LCSC; Type: 琴键; Circuit: 单刀单掷; Number of Positions: 2位; Lead Pitch: 2.54mm; Color: 红色
SW3 = MSK12C02-HB: 电路结构:单刀双掷;安装方式:卧贴;开关颜色:-;额定电流(DC):50mA;额定电压(DC):12V;额定电流(AC):-;额定电压(AC):-;机械寿命:1万次;; LCSC Part Name: 两档侧拨贴片 7脚拨动 黑柄,柄长1.5mm,带定位柱; Supplier Part: C431541; Manufacturer: SHOU HAN(首韩); Supplier Footprint: SMD; JLCPCB Part Class: Extended Part; Datasheet: https://atta.szlcsc.com/upload/public/pdf/source/20190925/C431541_43A76A06FD86AD8E3069A6BFECE3ABC5.pdf; Supplier: LCSC; Circuit: 单刀双掷; Pin Style: SMD接片; Switch Length: 8mm; Switch Width: 2.8mm; Switch Height: 1.4mm; Mounting Style: 卧贴; Current Rating (DC): 50mA; Voltage Rating (DC): 12V; Mechanical Life: 1万次; Operating Temperature: -20℃~+70℃
U1 = STM32F103C8T6: CPU内核:CM3;程序存储容量:64KB;RAM总容量:20KB;GPIO端口数量:37;工作电压范围:2V~3.6V;CPU最大主频:72MHz;程序存储器类型:FLASH;; LCSC Part Name: STM32F103C8T6 MSL=3; Supplier Part: C8734; Manufacturer: ST(意法半导体); Supplier Footprint: LQFP-48(7x7); JLCPCB Part Class: 扩展库; Datasheet: https://atta.szlcsc.com/upload/public/pdf/source/20220812/8363ACEC51AD55ECEB84799464F7CB85.pdf; Supplier: LCSC; CPU Core: CM3; Program Storage Size: 64KB; RAM Size: 20KB; GPIO Ports Number: 37; Operating Voltage Range: 2V~3.6V; CPU Maximum Speed: 72MHz; Program Memory Type: FLASH; Operating Temperature Range: -40℃~+85℃; ADC (Bit): 12bit; Universal Serial Bus: 有; Peripheral/Function: 看门狗；DMA；看门狗；片载温度传感器; Watchdog: 有; Infrared Data Association: 有; Low-Voltage Detect: 有; Direct Memory Access: 有; Internal Oscillator: 有
U2 = RT9193-33GB: 输出类型:固定;最大输入电压:5.5V;输出电压:3.3V;输出电流:300mA;电源纹波抑制比(PSRR):70dB@(100Hz)；50dB@(10kHz);输出极性:正极;; LCSC Part Name: 输入5.5V 输出3.3V 300mA; Supplier Part: C15651; Manufacturer: RICHTEK(立锜); Supplier Footprint: SOT-23-5; JLCPCB Part Class: Extended Part; Datasheet: https://atta.szlcsc.com/upload/public/pdf/source/20130730/1457706628575.pdf; Supplier: LCSC; Output Type: 固定; Maximum Input Voltage: 5.5V; Output Voltage: 3.3V; Output Current: 300mA; Power Supply Rejection Ratio (PSRR): 70dB@(100Hz)；50dB@(10kHz); Dropout Voltage: 300mV@(300mA); standby current: 130uA; Feature: 防静电保护；低ESR；热保护(TSD)；过流保护(OCP)；带使能; Operating Temperature: -40℃~+125℃; Output Polarity: 正极; Number of Outputs: 1
U3 = MST9220BSF: 功能类型:升压型;输入电压:2.5V~6V;输出电压:2.5V~10V;输出电流(最大值):2A;; Supplier Part: C324586; Manufacturer: MST(迈尔斯通); Supplier Footprint: SOT-23-6; JLCPCB Part Class: Extended Part; Datasheet: https://atta.szlcsc.com/upload/public/pdf/source/20181115/C324586_1339792CB7D64E8B95685BB57CD1A033.pdf; Supplier: LCSC; Function: 升压型; Input Voltage: 2.5V~6V; Output Voltage: 2.5V~10V; Output Current (Max): 2A; Switching Frequency: 1.2MHz; Synchronous Rectification: 否; Number of Outputs: 1; Topology: 升压式; Switch tube (built-in/external): 内置
U4 = TP4056-42-ESOP8: 锂电池充电芯片 42代表电池满电电压4.2V。; Supplier Part: C16581; Manufacturer: TOPPOWER(南京拓微); Supplier Footprint: ESOP-8; JLCPCB Part Class: Extended Part; Datasheet: https://atta.szlcsc.com/upload/public/pdf/source/20190626/C16581_611BCF5D7CF554EAE465137A8F68DB3E.pdf; Supplier: LCSC
U5 = MAX7219CWG+: 接口类型:4线串行接口;电源电压:4V~5.5V;; LCSC Part Name: 串行接口、8位、LED显示驱动器; Supplier Part: C1524040; Manufacturer: ADI(亚德诺)/MAXIM(美信); Supplier Footprint: SOIC-24-300mil; JLCPCB Part Class: 扩展库; Datasheet: https://atta.szlcsc.com/upload/public/pdf/source/20220511/BE3E638AD29B4A6F97CC59A3B78F270A.pdf; Supplier: LCSC; Configuration: 7段; Interface Type: 4线串行接口; Supply Voltage: 4V~5.5V; Operating Temperature: 0℃~+70℃
U6 = HC-PZ254-11.5L-1x3PZ: 插针结构:1x3P;间距:2.54mm;行距:-;圆针/方针:方针;安装类型:直插;排数:单排;总PIN位数:3P;额定电流:3A;配合针长度:6mm;塑高:2.5mm;端接针长度:3mm;触头材质:黄铜;触头镀层:金;工作温度范围:-40℃~+105℃;焊接温度(最大值):260℃;颜色:黑色;; LCSC Part Name: 间距2.54mm 1x3Pin 直插 H2.5 L11.5; Supplier Part: C27985188; Manufacturer: HC(虹成电子); Supplier Footprint: 插件,P=2.54mm; JLCPCB Part Class: 扩展库; Datasheet: https://atta.szlcsc.com/upload/public/pdf/source/20240710/98A645D37D09769D30EECF9A170B4A2C.pdf; Supplier: LCSC; Pin Structure: 1x3P; Pitch: 2.54mm; Circluar Pins/Square Pins: 方针; Mounting Type: 直插; Number of Rows: 单排; Number of Pins: 3P; Current Rating (Max): 3A; Length of Mating Pin: 6mm; Insulation Height: 2.5mm; Length of End Connection Pin: 3mm; Contact Material: 黄铜; Contact Plating: 金; Operating Temperature Range: -40℃~+105℃; Soldering Temperature(Max): 260℃; Color: 黑色
U7 = DS18B20: 温度范围:-55℃~+125℃;精度:±0.4℃;接口类型:-;; Supplier Part: C376006; Manufacturer: UMW(友台半导体); Supplier Footprint: TO-92; JLCPCB Part Class: 扩展库; Datasheet: https://atta.szlcsc.com/upload/public/pdf/source/20231109/DC3DA9D47D486EF40A6E0F08B9A498E3.pdf; Supplier: LCSC; Temperature range: -55℃~+125℃; Resolution: ±0.4℃; Supply Voltage: 3V~5.5V
U8 = HC-SR04: Supplier Part: C19857336; Manufacturer: Universal Microelectronics; JLCPCB Part Class: 扩展库; Datasheet: https://atta.szlcsc.com/upload/public/pdf/source/20240122/47B8E374E428935B7962A2189EF91AAC.pdf; Supplier: LCSC
USB1 = TYPE-C 16PIN 2MD(073): 连接器类型:Type-C;标准:-;公母:母座;触点数量:16;端口数量:1;安装方式:卧贴;额定电流 - 电源:5A;工作温度范围:-25℃~+85℃;; LCSC Part Name: TYPE-C母座 16P 4脚插件带定位柱 不锈钢外壳 2次模顶; Supplier Part: C2765186; Manufacturer: SHOU HAN(首韩); Supplier Footprint: SMD; JLCPCB Part Class: 扩展库; Supplier: LCSC; Connector Type: Type-C; Gender: 母座; Number of Contacts: 16; Number of Ports: 1; Mounting Style: 卧贴; Current Rating - Power (Max): 5A; Operating Temperature Range: -25℃~+85℃
USB2 = MICRO5.9mmusb: 连接器类型:Micro-B;标准:USB 2.0;公母:母;安装方式:卧贴;触点数量:5P;端口数量:1;额定电流 - 电源:1A;工作温度范围:-30℃~+80℃;; LCSC Part Name: Micro-B 母 卧贴; Supplier Part: C393940; Manufacturer: SHOU HAN(首韩); Supplier Footprint: SMD; JLCPCB Part Class: Extended Part; Datasheet: https://atta.szlcsc.com/upload/public/pdf/source/20190521/C393940_82CD1DF5E736059CF3459BCCC801B05D.pdf; Supplier: LCSC; Connector Type: Micro-B; Standard: USB 2.0; Gender: 母; Mounting Style: 卧贴; Number of Contacts: 5P; Number of Ports: 1; Current Rating - Power (Max): 1A; Operating Temperature Range: -30℃~+80℃; Core Colour: 黑色
X3 = XL2EL89COI-111YLC-8M: 晶振类型:贴片晶振;频率:8MHz;常温频差:±10ppm;外接负载电容:12pF;频率稳定度(全温):±20ppm;; LCSC Part Name: 8MHz ±10ppm 12pF; Supplier Part: C2973805; Manufacturer: YXC(扬兴晶振); Supplier Footprint: SMD3225-4P; JLCPCB Part Class: 扩展库; Datasheet: https://atta.szlcsc.com/upload/public/pdf/source/20240329/19D5F850207469550BEB00D7DFEDBC7A.pdf; Supplier: LCSC; Crystal Type: 贴片晶振; Normal temperature Frequency Tolerance: ±10ppm; External load capacitor: 12pF; Frequency Stability(Full temperature range): ±20ppm; Equivalent Series Resistance (ESR): 150Ω; Operating Temperature: -40℃~+85℃
X5 = X321532768KGD2SI: 晶振类型:贴片晶振;频率:32.768kHz;常温频差:±20ppm;外接负载电容:12.5pF;频率稳定度(全温):-;; LCSC Part Name: 32.768kHz ±20ppm 12.5pF; Supplier Part: C620155; Manufacturer: YXC(扬兴晶振); Supplier Footprint: SMD3215-2P; JLCPCB Part Class: 扩展库; Datasheet: https://atta.szlcsc.com/upload/public/pdf/source/20240329/3A7650FD985DD0DE85694D3785AB4916.pdf; Supplier: LCSC; Crystal Type: 贴片晶振; Normal temperature Frequency Tolerance: ±20ppm; External load capacitor: 12.5pF; Operating Temperature: -40℃~+85℃

## Nets
3V3: BUZZER1.1(+) C1.2 C16.2 C18.2 C19.2 C20.2 C21.2 C22.2 C24.2 C35.2 CN2输入.5 CN3输出.5 H1.4 H2.3 H3.1 H4.1 H5.1 H8.1 H12.1 LDO1.5(VOUT) R11.2 R12.2 R14.2 R19.1 R21.1 R22.1 U1.9(VDDA) U1.24(VDD_1) U1.36(VDD_2) U1.48(VDD_3) U2.5(VOUT) U5.19(V+) U6.1 U7.3(VDD) U8.1(VCC)
+5V: C8.2 C9.2 C10.2 C11.2 C15.2 C23.2 D1.2(K) H5.3 H9.1 LDO1.1(VIN) LDO1.3(CE) R5.1 USB1.2(VBUS) USB1.11(VBUS)
GND: C1.1 C2.1 C3.1 C4.1 C5.1 C6.1 C7.1 C9.1 C10.1 C11.1 C12.1 C15.1 C16.1 C17.1 C18.1 C19.1 C20.1 C21.1 C22.1 C23.1 C24.1 C27.1 C28.1 C33.1 C34.2 C35.1 CN1.2 CN2输入.4 CN3输出.4 H1.1 H2.1 H2.2 H3.3 H4.3 H5.2 H8.2 H9.2 H12.2 K1.3 K1.4 K2.3 K2.4 K3.3 K3.4 K4.3 K4.4 K5.3 K5.4 LDO1.2(VSS) LED1.1(C) LED2.1(C) LED5.1(C) Q1.3(C) R3.1 R6.1 R9.2 R10.2 SW1.1 U1.8(VSSA) U1.23(VSS_1) U1.35(VSS_2) U1.47(VSS_3) U2.2(GND) U3.2(GND) U4.1(TEMP) U4.3(GND) U4.9(EP) U5.4(GND) U5.9(GND) U6.3 U7.1(GND) U8.4(GND) USB1.1(GND) USB1.12(GND) USB1.13(SHELL) USB1.14(SHELL) USB2.5(GND) X3.2(GND) X3.4(GND)
VBAT: H2.20 U1.1(VBAT)
BAT: C5.2 C6.2 CN1.1 SW2.1 SW2.2 U4.5(BAT)
BAT_1: C7.2 L1.1 SW2.4 U3.4(EN) U3.5(VIN)
BAT_2: C2.2 SW2.3 U2.1(VIN) U2.3(EN)
BOOT0: R16.2 U1.44(BOOT0)
BOOT1: R15.1 U1.20(PB2)
CLK8: CN2输入.1 CN3输出.1 H2.9 U1.17(PA7) U5.13(CLK)
DIG0: LED3.12(DIG1) U5.2(DIG 0)
DIG1: LED3.9(DIG2) U5.11(DIG 1)
DIG2: LED3.8(DIG3) U5.6(DIG 2)
DIG3: LED3.6(DIG4) U5.7(DIG 3)
DIG4: LED4.12(DIG1) U5.3(DIG 4)
DIG5: LED4.9(DIG2) U5.10(DIG 5)
DIG6: LED4.8(DIG3) U5.5(DIG 6)
DIG7: LED4.6(DIG4) U5.8(DIG 7)
DIN8: CN2输入.3 H2.7 U1.19(PB1) U5.1(DIN)
DOUT8: CN3输出.3 U5.24(DOUT)
ISET8: R19.2 U5.18(ISET)
LOAD8: CN2输入.2 CN3输出.2 H2.8 U1.18(PB0) U5.12(LOAD)
NRST: C17.2 H2.4 R14.1 SW1.2 U1.7(NRST)
OSC32_IN: C27.2 H2.18 U1.3(PC14-OSC32_IN) X5.1
OSC32_OUT: C28.2 H2.17 U1.4(PC15-OSC32_OUT) X5.2
OSC_IN: C34.1 U1.5(PD0-OSC_IN) X3.1
OSC_OUT: C33.2 U1.6(PD1-OSC_OUT) X3.3
PA0: H2.16 U1.10(PA0-WKUP)
PA1: H2.15 U1.11(PA1)
PA2: H2.14 U1.12(PA2)
PA3: H2.13 R21.2 U1.13(PA3) U6.2 U7.2(DQ)
PA4: H2.12 R20.1 U1.14(PA4)
PA5: H2.11 U1.15(PA5)
PA6: H2.10 U1.16(PA6)
PA8: H5.16 U1.29(PA8)
PA9/USART1_TX: H5.15 U1.30(PA9)
PA10/USART1_RX: H5.14 U1.31(PA10)
PA13/SWDIO: H1.3 U1.34(PA13)
PA14/SWCLK: H1.2 U1.37(PA14)
PA15: H5.11 U1.38(PA15)
PB3: H5.10 U1.39(PB3)
PB4: H5.9 K1.1 K1.2 U1.40(PB4)
PB5: H5.8 K2.1 K2.2 U1.41(PB5)
PB6: H5.7 U1.42(PB6)
PB7: H5.6 U1.43(PB7)
PB8: H5.5 H12.3 U1.45(PB8)
PB9: H5.4 H12.4 U1.46(PB9)
PB10: H2.6 U1.21(PB10) U8.2(TRIG)
PB11: H2.5 U1.22(PB11) U8.3(ECHO)
PB12: H5.20 K3.1 K3.2 U1.25(PB12)
PB13: H5.19 U1.26(PB13)
PB14: H5.18 K4.1 K4.2 U1.27(PB14)
PB15: H5.17 U1.28(PB15)
PC13: H2.19 R13.2 U1.2(PC13-TAMPER-RTC)
SEGA8: LED3.11(A) LED4.11(A) U5.14(SEG A)
SEGB8: LED3.7(B) LED4.7(B) U5.16(SEG B)
SEGC8: LED3.4(C) LED4.4(C) U5.20(SEG C)
SEGD8: LED3.2(D) LED4.2(D) U5.23(SEG D)
SEGDP8: LED3.3(DP) LED4.3(DP) U5.22(SEG DP)
SEGE8: LED3.1(E) LED4.1(E) U5.21(SEG E)
SEGF8: LED3.10(F) LED4.10(F) U5.15(SEG F)
SEGG8: LED3.5(G) LED4.5(G) U5.17(SEG G)
USB_5V: R4.1 SW3.1
USB_D+_PA12: H5.12 R11.1 U1.33(PA12) USB1.6(DP1) USB1.8(DP2)
USB_D-_PA11: H5.13 K5.1 K5.2 U1.32(PA11) USB1.5(DN2) USB1.7(DN1)
$1N2054: R9.1 USB1.10(CC2)
$1N2066: R10.1 USB1.4(CC1)
$1N2074: LED1.2(A) R12.1
$1N2077: LED2.2(A) R13.1
$1N3296: H4.2 R15.2
$1N11047: H3.2 R16.1
$1N29860: Q1.1(B) R20.2
$1N29960: BUZZER1.2 Q1.2(E)
$1N30335: LED5.2(A) R22.2
C12_2: C12.2 U2.4(BP)
L1_2: D1.1(A) L1.2 U3.1(SW)
Net-(C3-2): C3.2 C4.2 G1.1(A) R4.2 R17.1(A) U4.4(VCC) U4.8(CE)
Net-(G1-2): G1.2(K) R2.1
Net-(R1-1): R1.1 R17.2(K)
R6_2: C8.1 R5.2 R6.2 U3.3(FB)
U1_2: R3.2 U4.2(PROG)
U1_6: R2.2 U4.6(STDBY#)
U1_7: R1.2 U4.7(CHRG#)
USB1_1: SW3.2 USB2.1(VBUS)

Not connected (* = marked no-connect by the designer): LDO1 4(NC)*; OLED1 1(GND) 2(VCC) 3(SCL) 4(SDA); SW3 3* 4*; U3 6(NC)*; USB1 3(SBU2)* 9(SBU1)*; USB2 2(D-)* 3(D+)* 4(ID)* 6*

## Notes on the sheet
- Type-C供电/下载
- LDO-5V转3.3V电路
- LED指示电路
- 复位电路
- BOOT模式选择
- 主控电源滤波
- SWD下载接口
- 1206封装
- 3.7V锂电池充电电路
- 锂电池转LDO_3V3输出
- STM32F103C8T6微控制器
- 3.7V锂电池充放电接口
- 锂电池升压_5V输出
- 8MHz和32.768kHz晶振电路
- 3.3v有源蜂鸣器
- 3.3vDS18B20温度传感器
- 共阴极八段数码管显示电路
- 外接传感器
- 控制按键
- 拓展排针接口
